# Altium schematic sheet shield I2C latest edit.SchDoc
size A
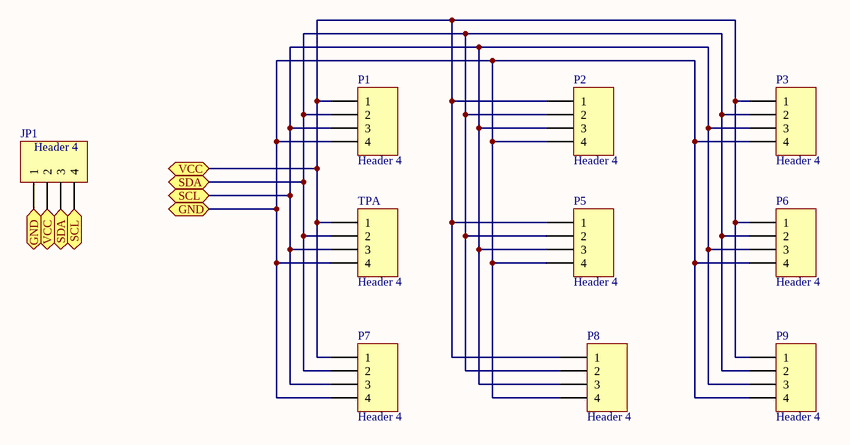
[diagram p0: shield I2C latest edit.SchDoc]

## Parts
JP1  Header 4  [HDR1X4]
P1  Header 4  [HDR1X4]
P2  Header 4  [HDR1X4]
P3  Header 4  [HDR1X4]
P5  Header 4  [HDR1X4]
P6  Header 4  [HDR1X4]
P7  Header 4  [HDR1X4]
P8  Header 4  [HDR1X4]
P9  Header 4  [HDR1X4]
TPA  Header 4  [HDR1X4]

## Ports
GND, SCL, SDA, VCC

## Nets
GND: JP1.1 P1.4 P2.4 P3.4 P5.4 P6.4 P7.4 P8.4 P9.4 TPA.4 ; port GND
SCL: JP1.4 P1.3 P2.3 P3.3 P5.3 P6.3 P7.3 P8.3 P9.3 TPA.3 ; port SCL
SDA: JP1.3 P1.2 P2.2 P3.2 P5.2 P6.2 P7.2 P8.2 P9.2 TPA.2 ; port SDA
VCC: JP1.2 P1.1 P2.1 P3.1 P5.1 P6.1 P7.1 P8.1 P9.1 TPA.1 ; port VCC

## Library data of the parts
JP1 P1-P3 P5-P9 TPA = Header 4: Header, 4-Pin; LatestRevisionDate: 17-Jul-2002; LatestRevisionNote: Re-released for DXP Platform.; Publisher: Altium Limited